# EAGLE schematic AtMEGA32u4-uSD-AddON (EAGLE 5.11)
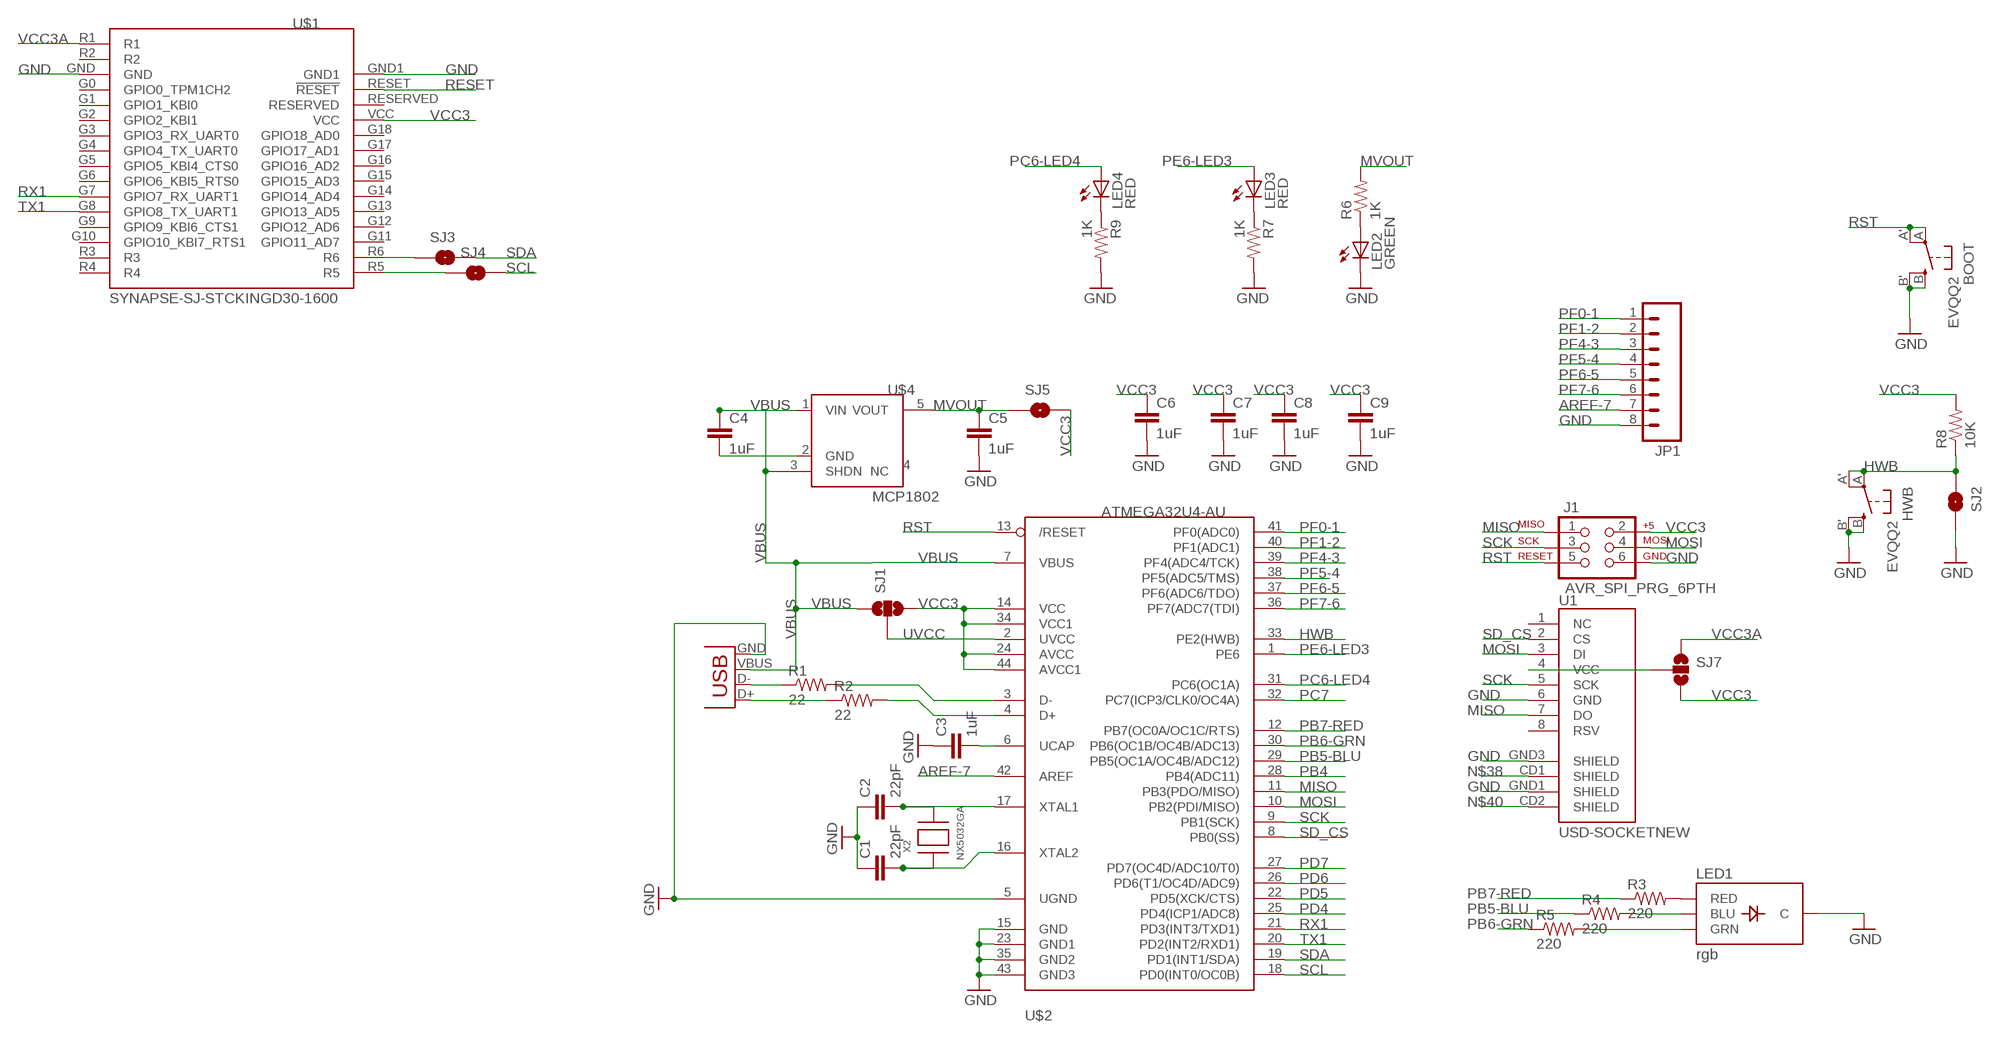
[diagram p0: schematic, sheet 1]

## Parts
BOOT  EVQQ2  [EVQ-Q2]
C1  22pF  CAP0603-CAP  [0603-CAP]
C2  22pF  CAP0603-CAP  [0603-CAP]
C3  1uF  CAP0603-CAP  [0603-CAP]
C4  1uF  CAP0603-CAP  [0603-CAP]
C5  1uF  CAP0603-CAP  [0603-CAP]
C6  1uF  CAP0603-CAP  [0603-CAP]
C7  1uF  CAP0603-CAP  [0603-CAP]
C8  1uF  CAP0603-CAP  [0603-CAP]
C9  1uF  CAP0603-CAP  [0603-CAP]
HWB  EVQQ2  [EVQ-Q2]
J1  AVR_SPI_PRG_6PTH  [2X3]
JP1  M08  [1X08]
LED1  rgb  LED-TRICOLOR-THROUGHHOLE  [LED-TRICOLOR-THROUGHHOLE]
LED2  GREEN  LED0603  [LED-0603]
LED3  RED  LED0603  [LED-0603]
LED4  RED  LED0603  [LED-0603]
R1  22  RESISTOR0603-RES  [0603-RES]
R2  22  RESISTOR0603-RES  [0603-RES]
R3  220  RESISTOR0603-RES  [0603-RES]
R4  220  RESISTOR0603-RES  [0603-RES]
R5  220  RESISTOR0603-RES  [0603-RES]
R6  1K  RESISTOR0603-RES  [0603-RES]
R7  1K  RESISTOR0603-RES  [0603-RES]
R8  10K  RESISTOR0603-RES  [0603-RES]
R9  1K  RESISTOR0603-RES  [0603-RES]
SJ1  SOLDERJUMPER_2WAYPASTE2&3  [SJ_3_PASTE2&3]
SJ2  HWB  SOLDERJUMPERTRACE  [SJ_2S-TRACE]
SJ3  SOLDERJUMPERTRACE  [SJ_2S-TRACE]
SJ4  SOLDERJUMPERTRACE  [SJ_2S-TRACE]
SJ5  SOLDERJUMPERNO  [SJ_2S-NO]
SJ7  SOLDERJUMPER_2WAYPASTE1&2  [SJ_3_PASTE1&2]
U1  USD-SOCKETNEW  [MICRO-SD-SOCKET-PP]
U$1  SYNAPSE-SJ-STCKINGD30-1600  [SYNSJ-STACK]
U$2  ATMEGA32U4-AU  [TQFP44]
U$4  MCP1802  [SOT23-5]
X1  USBSMD  [USB-MINIB]
X2  NX5032GA  XTALNX5032  [NX5032]

## Nets
AREF-7: JP1.7 U$2.42(AREF)
GND: BOOT.B'(S1) BOOT.B(S) C1.1 C2.1 C3.1 C4.2 C5.2 C6.2 C7.2 C8.2 C9.2 HWB.B'(S1) HWB.B(S) J1.6 JP1.8 LED1.GND(C) LED2.C R7.2 R9.2 SJ2.2 U1.6(GND) U1.GND1(SHIELD) U1.GND3(SHIELD) U$1.GND U$1.GND1 U$2.5(UGND) U$2.15(GND) U$2.23(GND1) U$2.35(GND2) U$2.43(GND3) U$4.2(GND) X1.GND
HWB [smallsignal]: HWB.A'(P1) HWB.A(P) R8.1 SJ2.1 U$2.33(PE2(HWB))
MISO: J1.1 U1.7(DO) U$2.11(PB3(PDO/MISO))
MOSI: J1.4 U1.3(DI) U$2.10(PB2(PDI/MISO))
MVOUT: C5.1 R6.2 SJ5.1 U$4.5(VOUT)
N$3: SJ7.2 U1.4(VCC)
N$4: C3.2 U$2.6(UCAP)
N$6: LED1.RED R3.2
N$7: LED1.BLU R4.2
N$8: LED2.A R6.1
N$9: LED4.C R9.1
N$10: LED3.C R7.1
N$11: SJ3.1 U$1.R6
N$12: LED1.GRN R5.2
N$13: SJ4.1 U$1.R5
N$38: U1.CD1(SHIELD)
N$40: U1.CD2(SHIELD)
PB4: U$2.28(PB4(ADC11))
PB5-BLU: R4.1 U$2.29(PB5(OC1A/OC4B/ADC12))
PB6-GRN: R5.1 U$2.30(PB6(OC1B/OC4B/ADC13))
PB7-RED: R3.1 U$2.12(PB7(OC0A/OC1C/RTS))
PC6-LED4: LED4.A U$2.31(PC6(OC1A))
PC7: U$2.32(PC7(ICP3/CLK0/OC4A))
PD4: U$2.25(PD4(ICP1/ADC8))
PD5: U$2.22(PD5(XCK/CTS))
PD6: U$2.26(PD6(T1/OC4D/ADC9))
PD7: U$2.27(PD7(OC4D/ADC10/T0))
PE6-LED3: LED3.A U$2.1(PE6)
PF0-1: JP1.1 U$2.41(PF0(ADC0))
PF1-2: JP1.2 U$2.40(PF1(ADC1))
PF4-3: JP1.3 U$2.39(PF4(ADC4/TCK))
PF5-4: JP1.4 U$2.38(PF5(ADC5/TMS))
PF6-5: JP1.5 U$2.37(PF6(ADC6/TDO))
PF7-6: JP1.6 U$2.36(PF7(ADC7(TDI))
RESET: U$1.RESET(!RESET)
RST [smallsignal]: BOOT.A'(P1) BOOT.A(P) J1.5 U$2.13(/RESET)
RX1: U$1.G7(GPIO7_RX_UART1) U$2.21(PD3(INT3/TXD1))
SCK: J1.3 U1.5(SCK) U$2.9(PB1(SCK))
SCL: SJ4.2 U$2.18(PD0(INT0/OC0B))
SD_CS: U1.2(CS) U$2.8(PB0(SS))
SDA: SJ3.2 U$2.19(PD1(INT1/SDA))
TX1: U$1.G8(GPIO8_TX_UART1) U$2.20(PD2(INT2/RXD1))
UD+: R2.2 U$2.4(D+)
UD-: R1.2 U$2.3(D-)
UDM: R1.1 X1.D-
UDP: R2.1 X1.D+
UVCC: SJ1.2 U$2.2(UVCC)
VBUS: C4.1 SJ1.1 U$2.7(VBUS) U$4.1(VIN) U$4.3(SHDN) X1.VBUS
VCC3: C6.1 C7.1 C8.1 C9.1 J1.2 R8.2 SJ1.3 SJ5.2 SJ7.3 U$1.VCC U$2.14(VCC) U$2.24(AVCC) U$2.34(VCC1) U$2.44(AVCC1)
VCC3A: SJ7.1 U$1.R1
XTAL1: C2.2 U$2.17(XTAL1) X2.P$2
XTAL2: C1.2 U$2.16(XTAL2) X2.P$1
Unconnected: U1.1(NC) U1.8(RSV) U$1.G0(GPIO0_TPM1CH2) U$1.G1(GPIO1_KBI0) U$1.G2(GPIO2_KBI1) U$1.G3(GPIO3_RX_UART0) U$1.G4(GPIO4_TX_UART0) U$1.G5(GPIO5_KBI4_CTS0) U$1.G6(GPIO6_KBI5_RTS0) U$1.G9(GPIO9_KBI6_CTS1) U$1.G10(GPIO10_KBI7_RTS1) U$1.G11(GPIO11_AD7) U$1.G12(GPIO12_AD6) U$1.G13(GPIO13_AD5) U$1.G14(GPIO14_AD4) U$1.G15(GPIO15_AD3) U$1.G16(GPIO16_AD2) U$1.G17(GPIO17_AD1) U$1.G18(GPIO18_AD0) U$1.R2 U$1.R3 U$1.R4 U$1.RESERVED U$4.4(NC)

## Library data of the parts
BOOT HWB = adaprog:EVQQ2
C1 C2 = SparkFun:CAP: Capacitor Standard 0603 ceramic capacitor, and 0.1" leaded capacitor.
C3-C9 = 0_jc-custom:CAP: Capacitor Standard 0603 ceramic capacitor, and 0.1" leaded capacitor.
J1 = SparkFun:AVR_SPI_PRG_6: AVR ISP 6 Pin This is the reduced ISP connector for AVR programming. Common on Arduino. This footprint will take up less PCB space and can be used with a 10-pin to 6-pin adapter such as SKU: BOB-08508
JP1 = SparkFun:M08: Header 8 Standard 8-pin 0.1" header. Use with straight break away headers (SKU : PRT-00116), right angle break away headers (PRT-00553), swiss pins (PRT-00743), machine pins (PRT-00117), and female headers (PRT-00115).
LED1 = SparkFun:LED-TRICOLOR-THROUGHHOLE
LED2-LED4 = 0_jc-custom:LED: LEDs Standard schematic elements and footprints for 5mm, 3mm, 1206, and 0603 sized LEDs. 5mm - Spark Fun Electronics SKU : COM-00529 (and others)
R1-R9 = 0_jc-custom:RESISTOR
SJ1 SJ7 = SparkFun:SOLDERJUMPER_2WAY: Solder Jumper 2 way solder jumper
SJ2-SJ5 = SparkFun:SOLDERJUMPER: Solder Jumper Standard SMD solder jumper. Used to automate production. Two varients : Normally Open and Normally Closed are the same, but have different paste layers. NC will have a large amount of paste and should jumper during reflow.
U1 = 0_jc-modified:USD-SOCKET: microSD Socket Push-push type uSD socket. Schematic element and footprint production proven. Spark Fun Electronics SKU : PRT-00127. tDoc lines correctly indicate media card edge positions when inserting (unlocked, locked, depressed).
U$1 = 0_jc-custom:SYNAPSE-SJ-STCKING: Standard layout for expansion modules using Synapse Wireless boards
U$2 = adafruit:ATMEGA32U4: http://www.ladyada.net/library/eagle
U$4 = 0_jc-custom:MCP1802
X1 = 0_jc-custom:USB: USB Connectors USB-B-PTH is fully proven SKU : PRT-00139 USB-miniB is fully proven SKU : PRT-00587 USB-A-PCB is untested. USB-A-H is throughly reviewed, but untested. Spark Fun Electronics SKU : PRT-00437 USB-B-SMT is throughly reviewed, but untested. Needs silkscreen touching up. USB-A-S has not been used/tested USB-MB-H has not been used/tested
X2 = adafruit:XTAL: Low cost SMT crystals, no capacitors included http://www.ladyada.net/library/eagle

## Net classes
0 default: width 0.254 mm
1 smallsignal: width 0.152 mm
2 bigsignal: width 0.356 mm